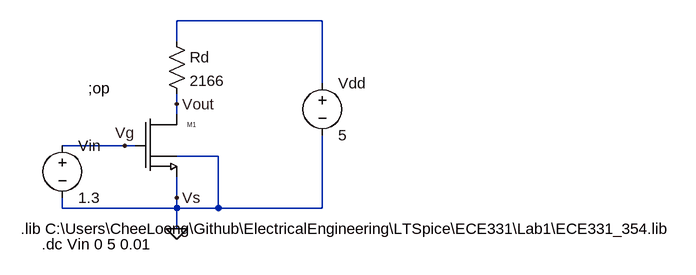
[diagram p0: schematic Lab1_1_4_Soon_Wang.asc]
Lab1_1_4_Soon_Wang.asc, the LTspice schematic file:
Version 4
SHEET 1 1120 680
WIRE 384 -32 160 -32
WIRE 160 0 160 -32
WIRE 384 64 384 -32
WIRE 160 96 160 80
WIRE 160 112 160 96
WIRE 80 160 -16 160
WIRE 96 160 80 160
WIRE 224 176 160 176
WIRE 160 240 160 208
WIRE -16 256 -16 240
WIRE 160 256 160 240
WIRE 160 256 -16 256
WIRE 224 256 224 176
WIRE 224 256 160 256
WIRE 384 256 384 144
WIRE 384 256 224 256
WIRE 160 288 160 256
FLAG 160 288 0
FLAG 160 96 Vout
FLAG 160 240 Vs
FLAG 80 160 Vg
SYMBOL ALD1101 96 112 R0
SYMATTR InstName M1
SYMATTR SpiceModel ""
SYMATTR SpiceLine ""
SYMATTR Value ALD1101
SYMATTR Value2 W=1.379e-3 L=1E-6
SYMBOL voltage -16 144 R0
WINDOW 123 0 0 Left 2
WINDOW 39 0 0 Left 2
SYMATTR InstName Vin
SYMATTR Value 1.3
SYMBOL voltage 384 48 R0
WINDOW 123 0 0 Left 2
WINDOW 39 0 0 Left 2
SYMATTR InstName Vdd
SYMATTR Value 5
SYMBOL res 144 -16 R0
SYMATTR InstName Rd
SYMATTR Value 2166
TEXT -48 312 Left 2 !.dc Vin 0 5 0.01
TEXT -80 288 Left 2 !.lib C:\\Users\\CheeLoong\\Github\\ElectricalEngineering\\LTSpice\\ECE331\\Lab1\\ECE331_354.lib
TEXT 24 72 Left 2 !;op

The netlist it stands for:
* Lab1_1_4_Soon_Wang.asc
M1 Vout Vg 0 0 ALD1101 W=1.379e-3 L=1E-6
Vin Vg 0 1.3
Vdd N001 0 5
Rd N001 Vout 2166
.model NMOS NMOS
.model PMOS PMOS
.lib standard.mos
.dc Vin 0 5 0.01
.lib C:\Users\CheeLoong\Github\ElectricalEngineering\LTSpice\ECE331\Lab1\ECE331_354.lib
;op
.backanno
.end

* Results of the author's LTspice run, read from the files saved beside the schematic
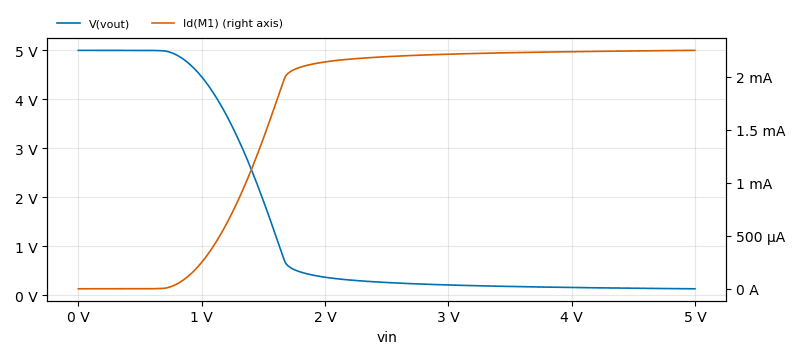
[diagram p1: DC transfer characteristic of Lab1_1_4_Soon_Wang.asc, plotted from the saved traces]
* DC transfer characteristic, 1 run:
*   V(vout): 5 V at vin=0 V, 128.9 mV at vin=5 V, min 128.9 mV, max 5 V
*   Id(M1): 21.44 pA at vin=0 V, 2.249 mA at vin=5 V, min 21.44 pA, max 2.249 mA